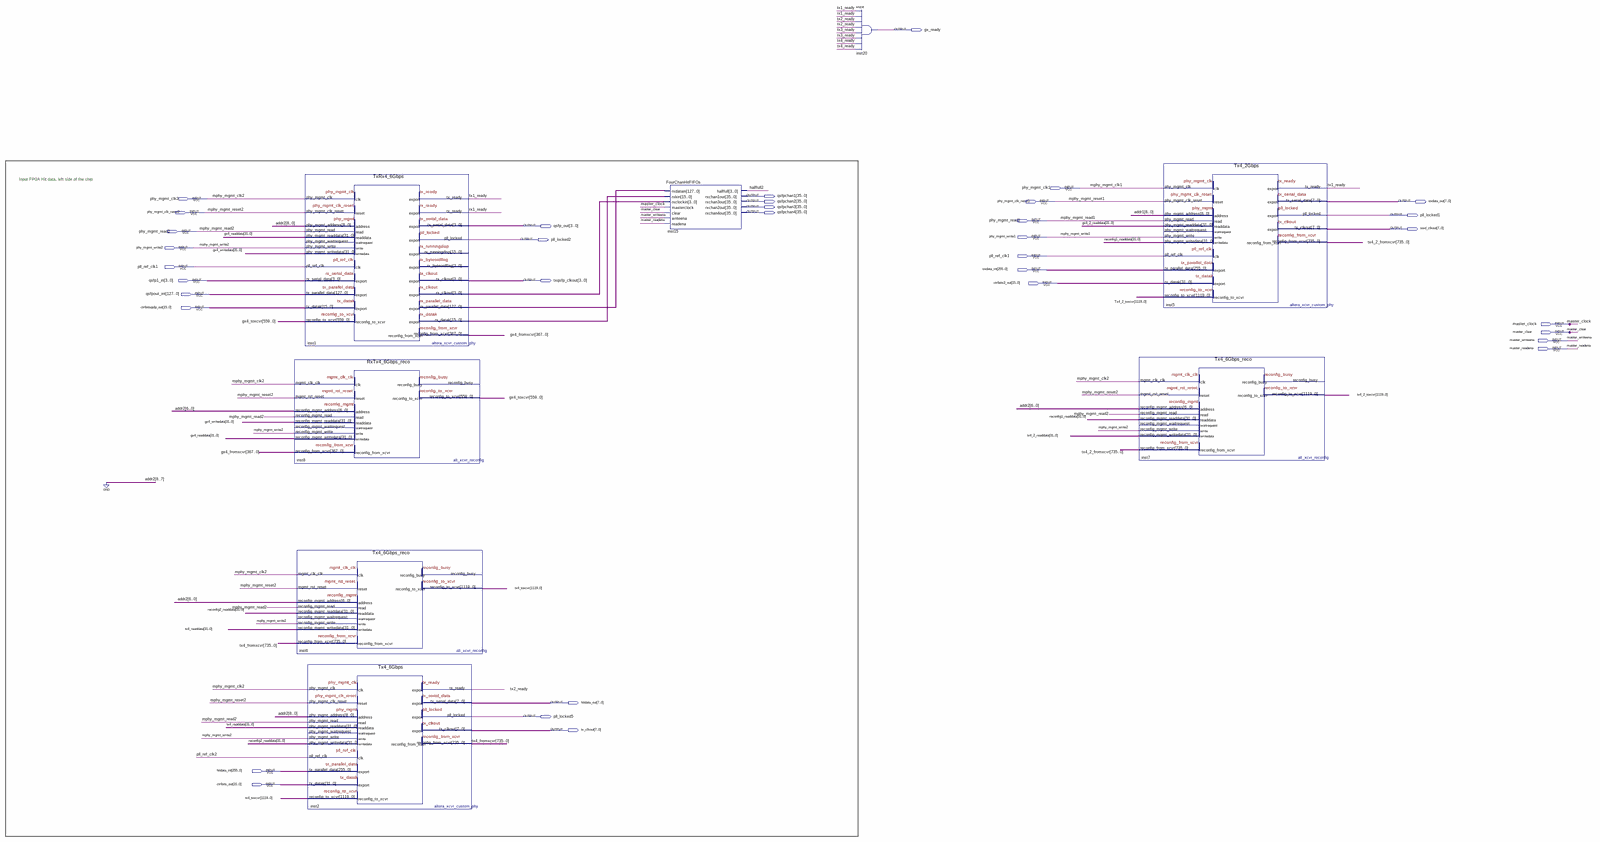
[diagram p0: schematic sheet, whole]
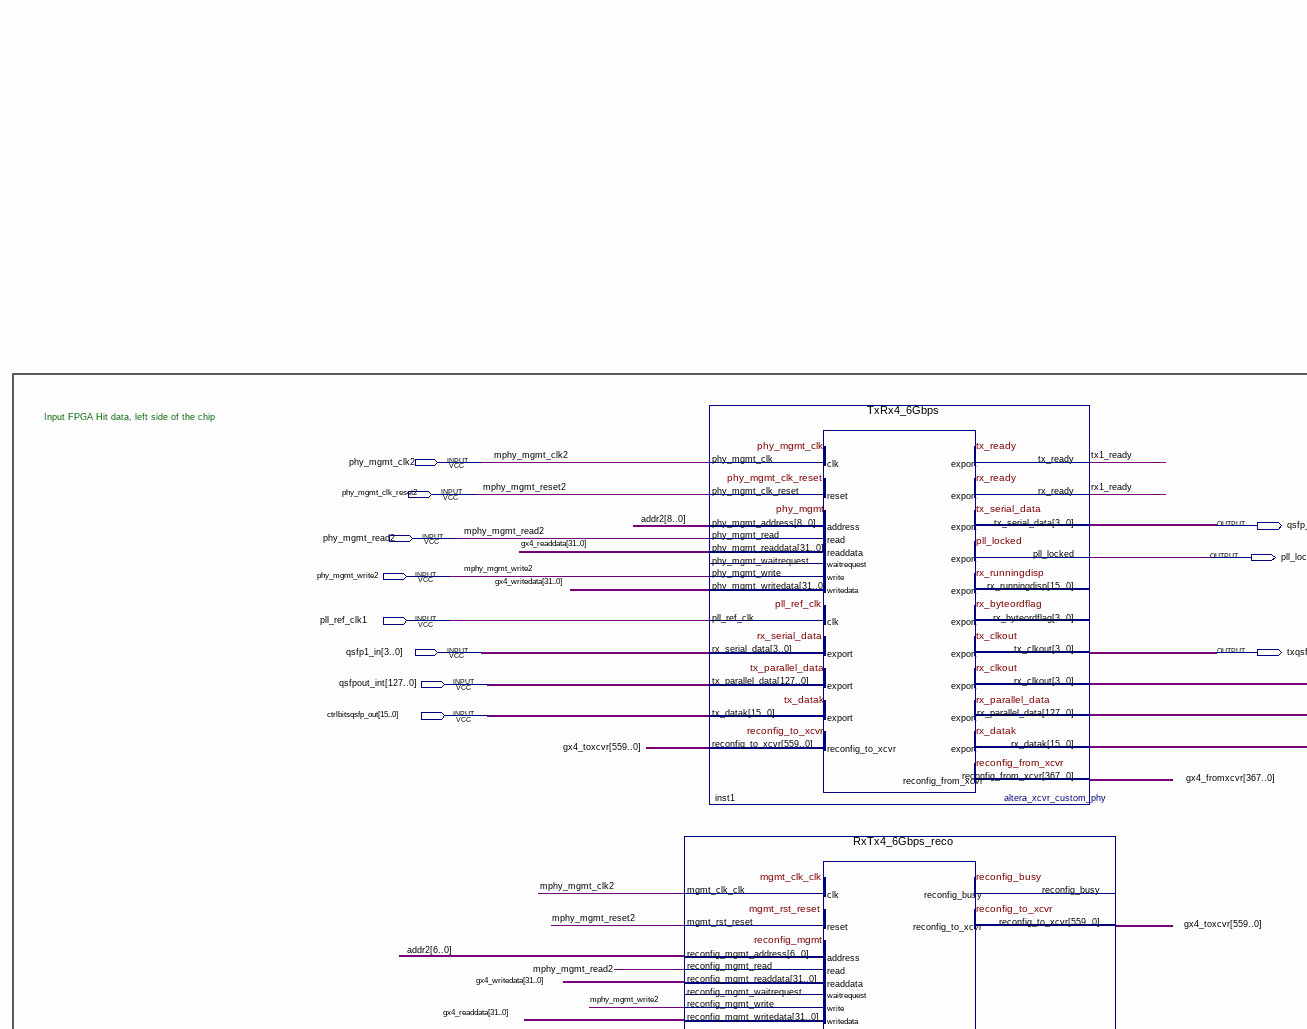
[diagram p1: schematic sheet, upper left part]
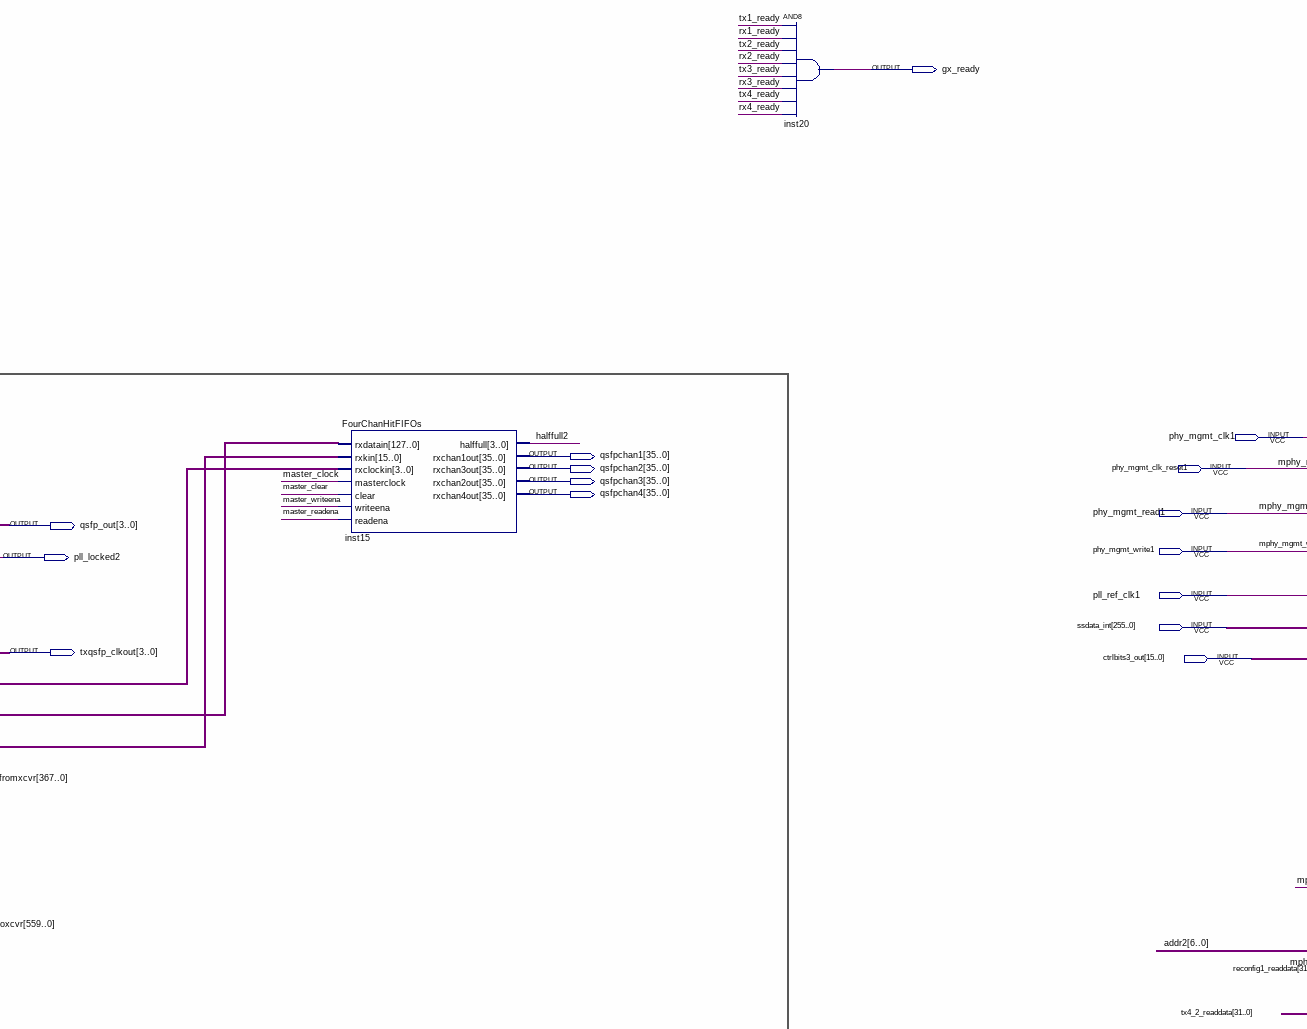
[diagram p2: schematic sheet, upper centre part]
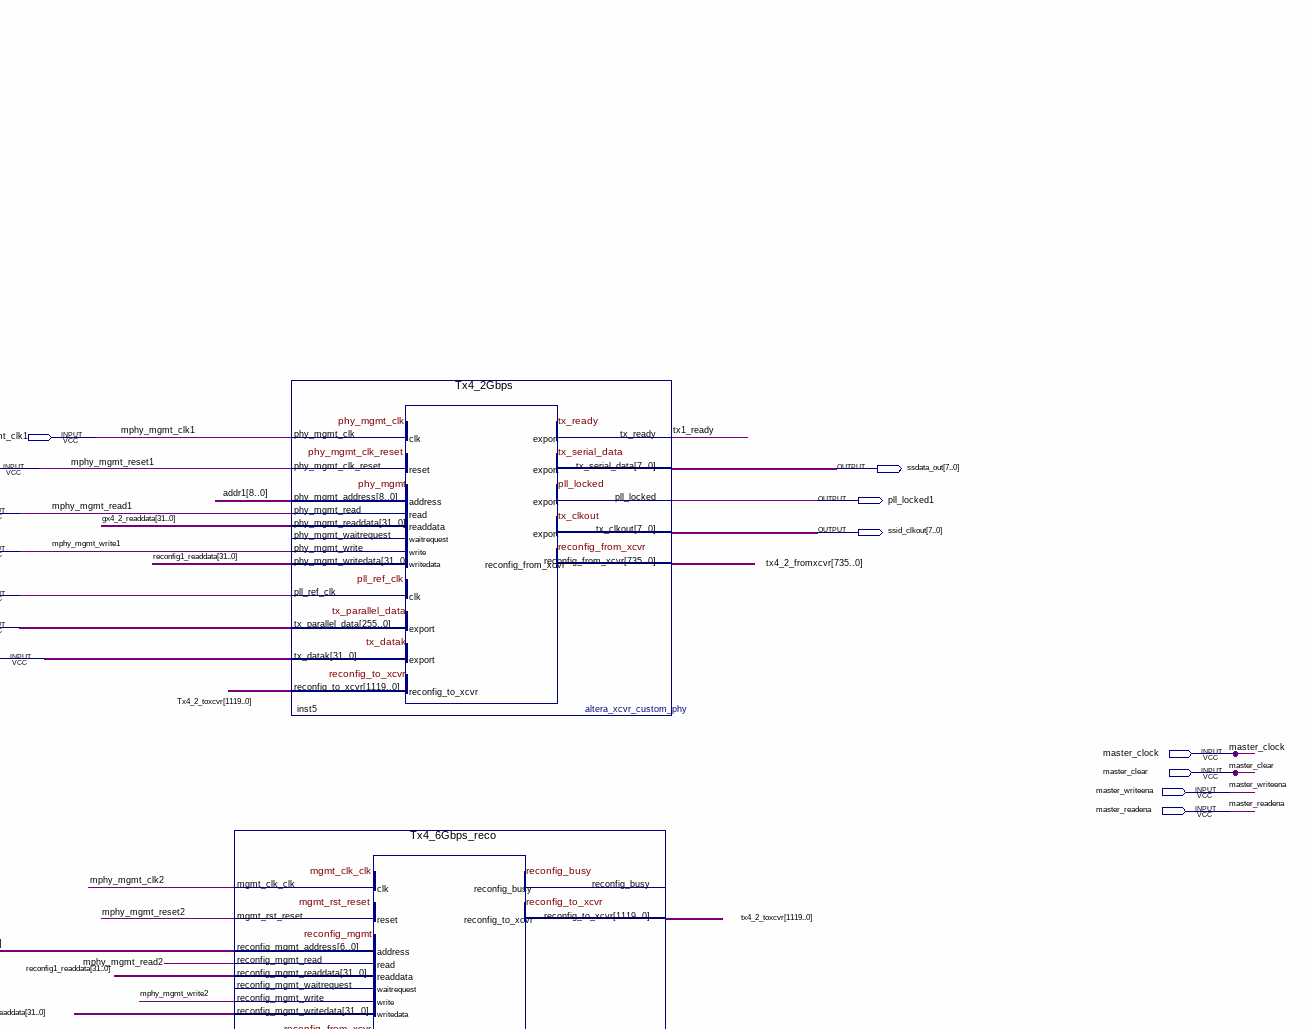
[diagram p3: schematic sheet, upper right part]
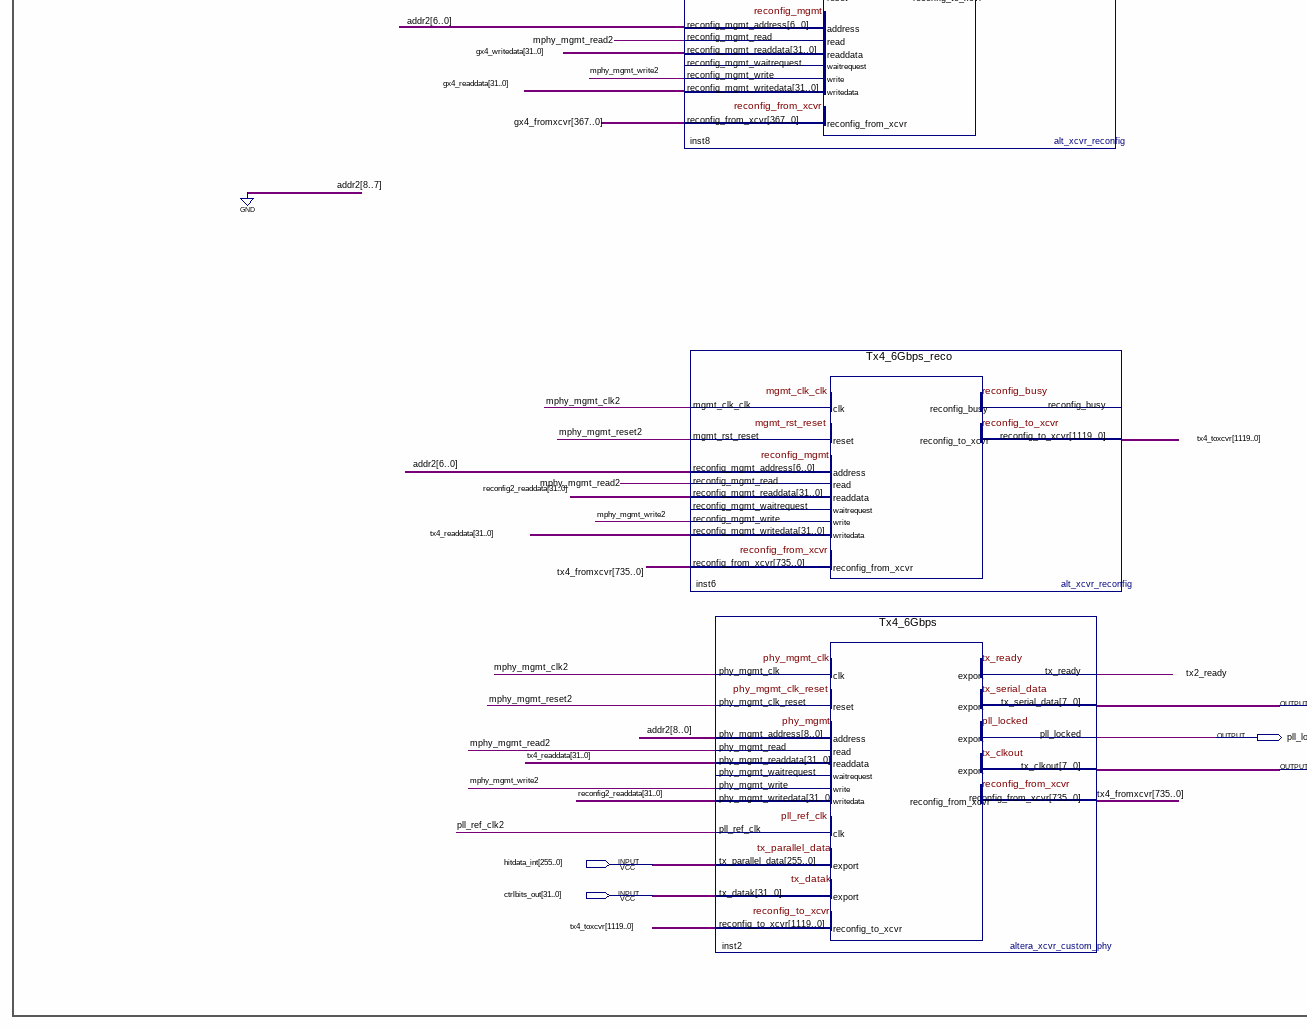
[diagram p4: schematic sheet, lower left part]
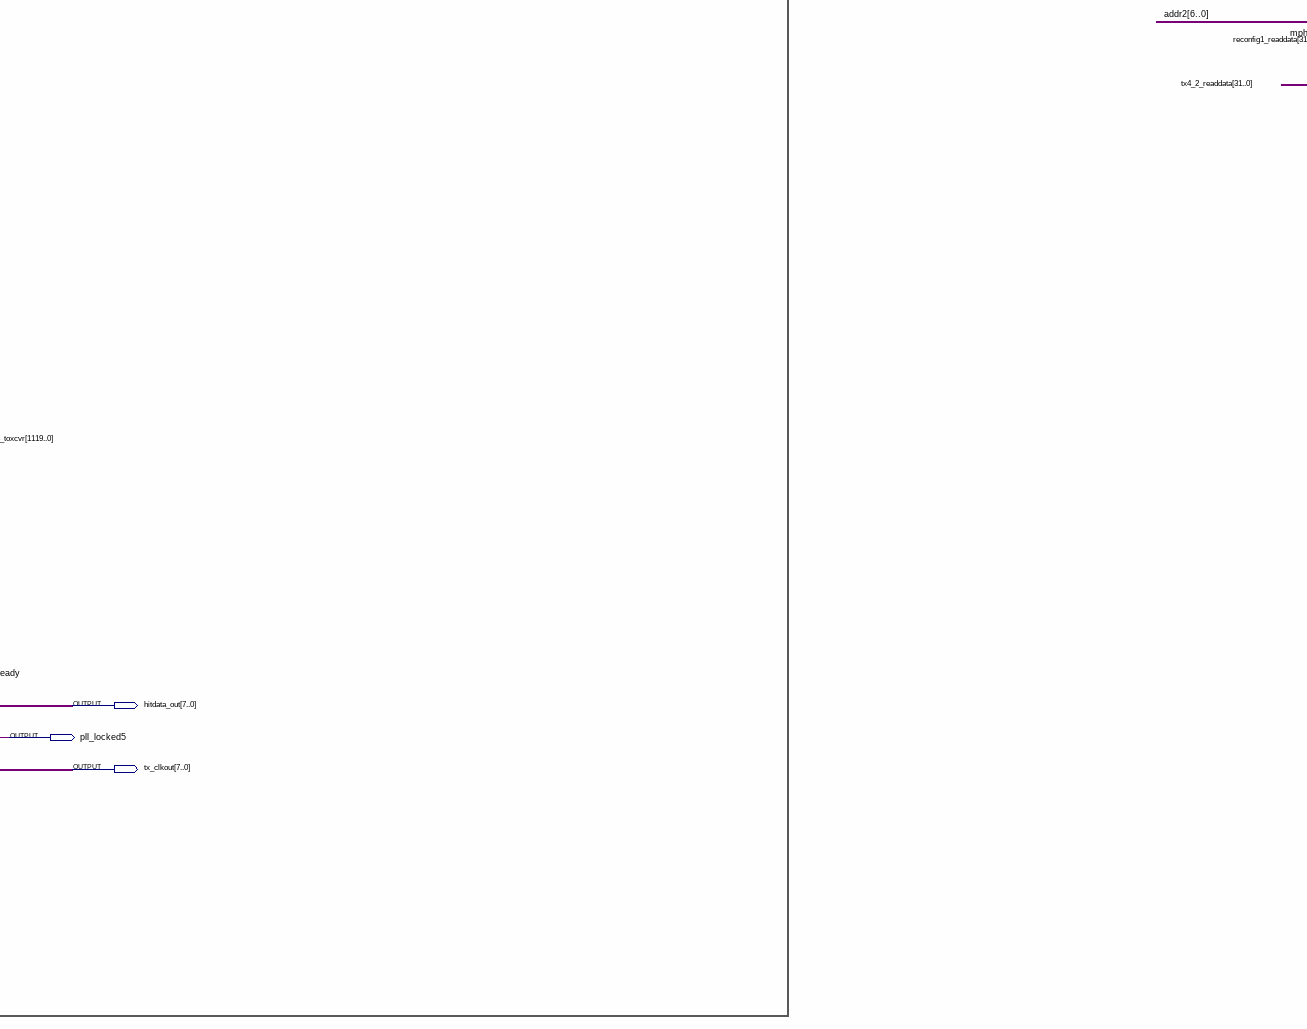
[diagram p5: schematic sheet, lower centre part]
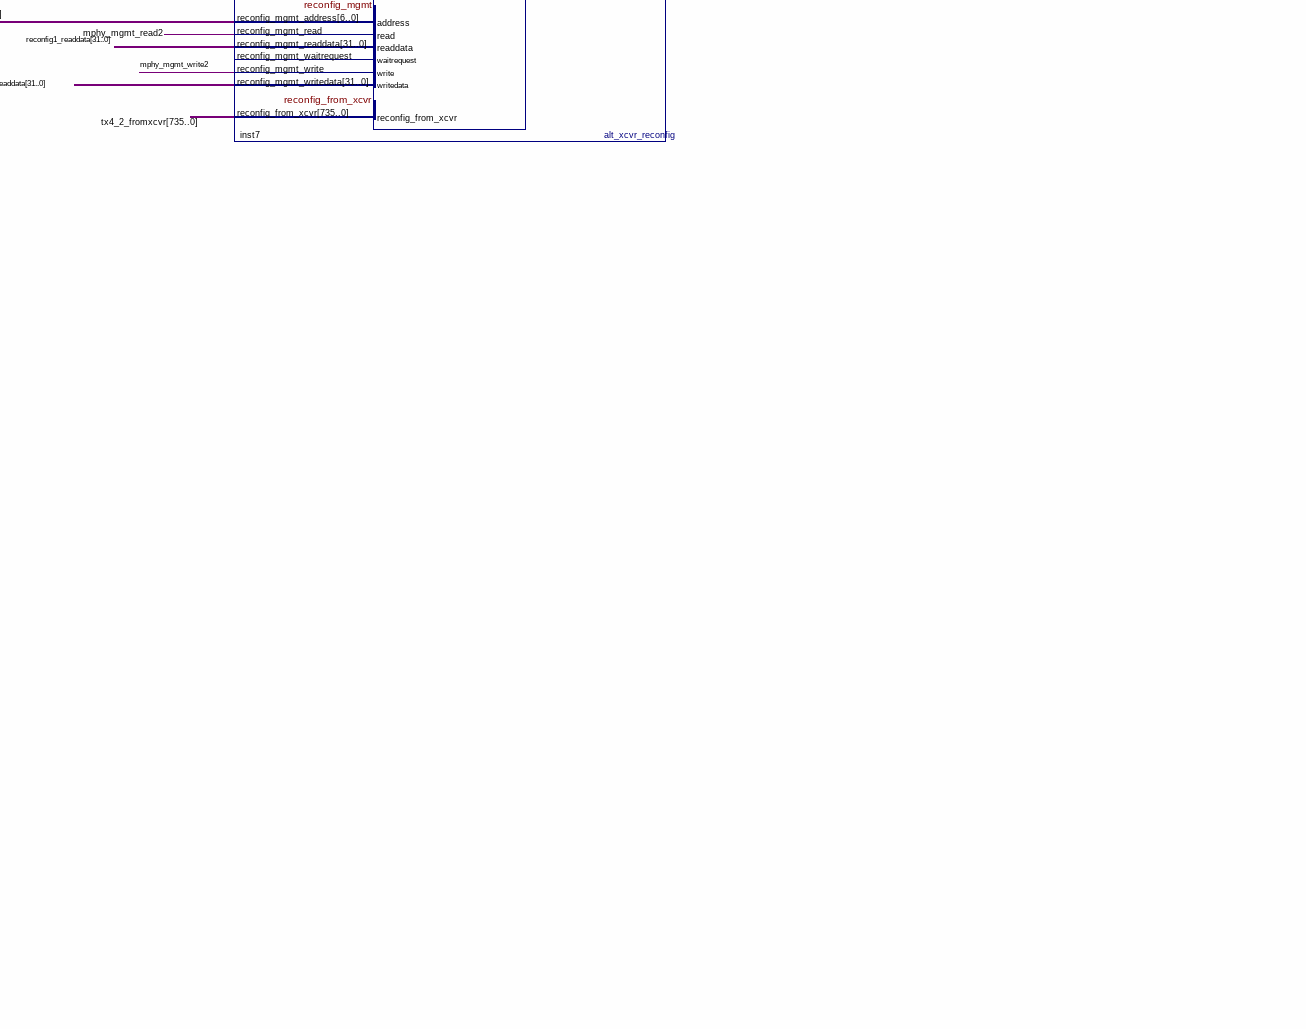
[diagram p6: schematic sheet, lower right part]
// Quartus schematic RxBlock.bdf as structural Verilog: 8 symbols, 35 pins
module RxBlock (
  input  phy_mgmt_clk1,
  input  phy_mgmt_clk2,
  input  phy_mgmt_clk_reset1,
  input  phy_mgmt_clk_reset2,
  input  phy_mgmt_read1,
  input  phy_mgmt_read2,
  input  phy_mgmt_write1,
  input  phy_mgmt_write2,
  input  pll_ref_clk1,
  input  [255:0] ssdata_int,
  input  [3:0] qsfp1_in,
  input  [15:0] ctrlbits3_out,
  input  [127:0] qsfpout_int,
  input  [15:0] ctrlbitsqsfp_out,
  input  master_clock,
  input  master_clear,
  input  master_writeena,
  input  master_readena,
  input  [255:0] hitdata_int,
  input  [31:0] ctrlbits_out,
  output gx_ready,
  output [35:0] qsfpchan1,
  output [35:0] qsfpchan2,
  output [7:0] ssdata_out,
  output [35:0] qsfpchan3,
  output [35:0] qsfpchan4,
  output pll_locked1,
  output [3:0] qsfp_out,
  output [7:0] ssid_clkout,
  output pll_locked2,
  output [3:0] txqsfp_clkout,
  output [7:0] hitdata_out,
  output pll_locked5,
  output [7:0] tx_clkout
);

  wire halffull2, pll_ref_clk2, rx1_ready, rx2_ready, rx3_ready, rx4_ready, tx1_ready, tx2_ready, tx3_ready,
       tx4_ready;
  wire [3:0] inst1_rx_clkout;
  wire [6:0] addr2;
  wire [8:0] addr1;
  wire [15:0] inst1_rx_datak;
  wire [31:0] gx4_2_readdata, gx4_readdata, gx4_writedata, reconfig1_readdata, reconfig2_readdata,
       tx4_2_readdata, tx4_readdata;
  wire [127:0] inst1_rx_parallel_data;
  wire [367:0] gx4_fromxcvr;
  wire [559:0] gx4_toxcvr;
  wire [735:0] tx4_2_fromxcvr, tx4_fromxcvr;
  wire [1119:0] Tx4_2_toxcvr, tx4_toxcvr;

  TxRx4_6Gbps inst1 (
    .phy_mgmt_clk(phy_mgmt_clk2), .phy_mgmt_clk_reset(phy_mgmt_clk_reset2),
    .phy_mgmt_address({2'b00, addr2}), .phy_mgmt_read(phy_mgmt_read2), .phy_mgmt_write(phy_mgmt_write2),
    .phy_mgmt_writedata(gx4_writedata), .pll_ref_clk(pll_ref_clk1), .rx_serial_data(qsfp1_in),
    .tx_parallel_data(qsfpout_int), .tx_datak(ctrlbitsqsfp_out), .reconfig_to_xcvr(gx4_toxcvr),
    .phy_mgmt_readdata(gx4_readdata), .tx_ready(tx1_ready), .rx_ready(rx1_ready), .tx_serial_data(qsfp_out),
    .pll_locked(pll_locked2), .tx_clkout(txqsfp_clkout), .rx_clkout(inst1_rx_clkout),
    .rx_parallel_data(inst1_rx_parallel_data), .rx_datak(inst1_rx_datak), .reconfig_from_xcvr(gx4_fromxcvr));  // open: phy_mgmt_waitrequest, rx_runningdisp, rx_byteordflag
  RxTx4_6Gbps_reco inst8 (
    .mgmt_clk_clk(phy_mgmt_clk2), .mgmt_rst_reset(phy_mgmt_clk_reset2), .reconfig_mgmt_address(addr2),
    .reconfig_mgmt_read(phy_mgmt_read2), .reconfig_mgmt_write(phy_mgmt_write2),
    .reconfig_mgmt_writedata(gx4_readdata), .reconfig_from_xcvr(gx4_fromxcvr),
    .reconfig_mgmt_readdata(gx4_writedata), .reconfig_to_xcvr(gx4_toxcvr));  // open: reconfig_busy, reconfig_mgmt_waitrequest
  Tx4_6Gbps_reco inst6 (
    .mgmt_clk_clk(phy_mgmt_clk2), .mgmt_rst_reset(phy_mgmt_clk_reset2), .reconfig_mgmt_address(addr2),
    .reconfig_mgmt_read(phy_mgmt_read2), .reconfig_mgmt_write(phy_mgmt_write2),
    .reconfig_mgmt_writedata(tx4_readdata), .reconfig_from_xcvr(tx4_fromxcvr),
    .reconfig_mgmt_readdata(reconfig2_readdata), .reconfig_to_xcvr(tx4_toxcvr));  // open: reconfig_busy, reconfig_mgmt_waitrequest
  Tx4_6Gbps inst2 (
    .phy_mgmt_clk(phy_mgmt_clk2), .phy_mgmt_clk_reset(phy_mgmt_clk_reset2),
    .phy_mgmt_address({2'b00, addr2}), .phy_mgmt_read(phy_mgmt_read2), .phy_mgmt_write(phy_mgmt_write2),
    .phy_mgmt_writedata(reconfig2_readdata), .pll_ref_clk(pll_ref_clk2), .tx_parallel_data(hitdata_int),
    .tx_datak(ctrlbits_out), .reconfig_to_xcvr(tx4_toxcvr), .phy_mgmt_readdata(tx4_readdata),
    .tx_ready(tx2_ready), .tx_serial_data(hitdata_out), .pll_locked(pll_locked5), .tx_clkout(tx_clkout),
    .reconfig_from_xcvr(tx4_fromxcvr));  // open: phy_mgmt_waitrequest
  FourChanHitFIFOs inst15 (
    .rxdatain(inst1_rx_parallel_data), .rxkin(inst1_rx_datak), .rxclockin(inst1_rx_clkout),
    .masterclock(master_clock), .clear(master_clear), .writeena(master_writeena), .readena(master_readena),
    .halffull(halffull2), .rxchan1out(qsfpchan1), .rxchan3out(qsfpchan2), .rxchan2out(qsfpchan3),
    .rxchan4out(qsfpchan4));
  and inst20 (gx_ready, tx1_ready, rx1_ready, tx2_ready, rx2_ready, tx3_ready, rx3_ready, tx4_ready, rx4_ready);
  Tx4_6Gbps_reco inst7 (
    .mgmt_clk_clk(phy_mgmt_clk2), .mgmt_rst_reset(phy_mgmt_clk_reset2), .reconfig_mgmt_address(addr2),
    .reconfig_mgmt_read(phy_mgmt_read2), .reconfig_mgmt_write(phy_mgmt_write2),
    .reconfig_mgmt_writedata(tx4_2_readdata), .reconfig_from_xcvr(tx4_2_fromxcvr),
    .reconfig_mgmt_readdata(reconfig1_readdata), .reconfig_to_xcvr(Tx4_2_toxcvr));  // open: reconfig_busy, reconfig_mgmt_waitrequest
  Tx4_2Gbps inst5 (
    .phy_mgmt_clk(phy_mgmt_clk1), .phy_mgmt_clk_reset(phy_mgmt_clk_reset1), .phy_mgmt_address(addr1),
    .phy_mgmt_read(phy_mgmt_read1), .phy_mgmt_write(phy_mgmt_write1),
    .phy_mgmt_writedata(reconfig1_readdata), .pll_ref_clk(pll_ref_clk1), .tx_parallel_data(ssdata_int),
    .tx_datak(ctrlbits3_out), .reconfig_to_xcvr(Tx4_2_toxcvr), .phy_mgmt_readdata(gx4_2_readdata),
    .tx_ready(tx1_ready), .tx_serial_data(ssdata_out), .pll_locked(pll_locked1), .tx_clkout(ssid_clkout),
    .reconfig_from_xcvr(tx4_2_fromxcvr));  // open: phy_mgmt_waitrequest

  // Other names for the same wires on the sheet: mphy_mgmt_clk1 = phy_mgmt_clk1; mphy_mgmt_clk2 = phy_mgmt_clk2;
  //   mphy_mgmt_read1 = phy_mgmt_read1; mphy_mgmt_read2 = phy_mgmt_read2; mphy_mgmt_reset1 = phy_mgmt_clk_reset1;
  //   mphy_mgmt_reset2 = phy_mgmt_clk_reset2; mphy_mgmt_write1 = phy_mgmt_write1; mphy_mgmt_write2 = phy_mgmt_write2

  // Notes on the sheet:
  //   Input FPGA Hit data, left side of the chip
endmodule
